# Altium schematic sheet [03] - Master_MCU.SchDoc: =ProjectName
size A4; CheckedBy: Ven; Author: Ven; CompanyName: HUST; Revision: V.1.0
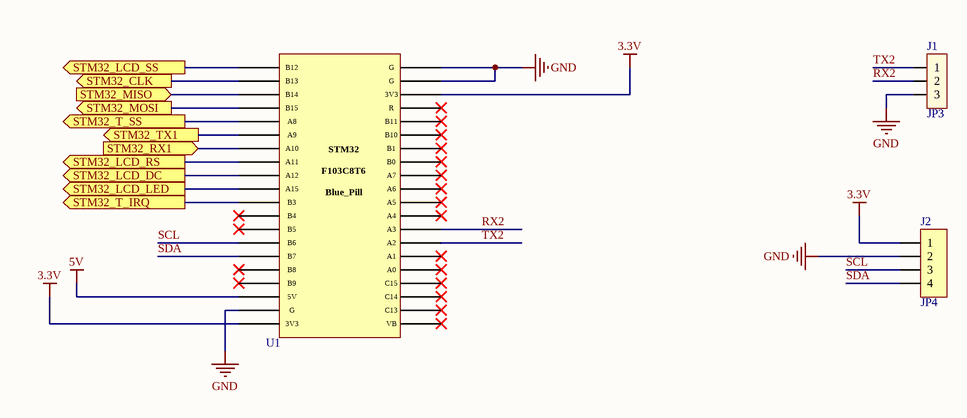
[diagram p0: [03] - Master_MCU.SchDoc]

## Parts
J1  JP3  [JP3]
J2  JP4  [J4-D1T]
U1  STM32 Bluepill  [Blue_Pill_Board]  (value not drawn)

## Ports
STM32_CLK (out), STM32_LCD_DC (out), STM32_LCD_LED (out), STM32_LCD_RS (out), STM32_LCD_SS (out), STM32_MISO (in), STM32_MOSI (out), STM32_RX1 (in), STM32_T_IRQ (out), STM32_T_SS (out), STM32_TX1 (out)

## Nets
3.3V: J2.1 U1.20(3V3) U1.23(3V3)
5V: U1.18(5V)
GND: J1.3 J2.2 U1.19(G) U1.21(G) U1.22(G)
RX2: J1.2 U1.33(A3)
SCL: J2.3 U1.14(B6)
SDA: J2.4 U1.15(B7)
STM32_CLK: U1.2(B13) ; port STM32_CLK
STM32_LCD_DC: U1.9(A12) ; port STM32_LCD_DC
STM32_LCD_LED: U1.10(A15) ; port STM32_LCD_LED
STM32_LCD_RS: U1.8(A11) ; port STM32_LCD_RS
STM32_LCD_SS: U1.1(B12) ; port STM32_LCD_SS
STM32_MISO: U1.3(B14) ; port STM32_MISO
STM32_MOSI: U1.4(B15) ; port STM32_MOSI
STM32_RX1: U1.7(A10) ; port STM32_RX1
STM32_T_IRQ: U1.11(B3) ; port STM32_T_IRQ
STM32_T_SS: U1.5(A8) ; port STM32_T_SS
STM32_TX1: U1.6(A9) ; port STM32_TX1
TX2: J1.1 U1.34(A2)

Not connected (* = marked no-connect by the designer): U1 12(B4)* 13(B5)* 16(B8)* 17(B9)* 24(R)* 25(B11)* 26(B10)* 27(B1)* 28(B0)* 29(A7)* 30(A6)* 31(A5)* 32(A4)* 35(A1)* 36(A0)* 37(C15)* 38(C14)* 39(C13)* 40(VB)*

## Notes on the sheet
- Project:
- Page Contents:
- Size:
- Date:
- A4
- Checked by:
- Time:
- Revision:
- Sheet
- of
- File:
- (in symbol STM32 Bluepill) / STM32 / F103C8T6 / Blue_Pill

## Library data of the parts
J1 = JP3: UART2; Value: J3
J2 = JP4x1-2.0: I2C; Manufacturer: W¨¹rth Elektronik eiSos GmbH; partNo: 62000411821; ComponentLink1 Description: Manufacturer; ComponentLink2 Description: Datasheet; NoPins: 04; Created Date: 2 April 2013; ComponentLink1URL: http://www.we-online.com; ComponentLink2URL: http://katalog.we-online.de/em/datasheet/6200xx11821.pdf; Created by: Karrer Zheng
U1 = STM32 Bluepill: STM32 Bluepill Kit